# EAGLE design adaptive (EAGLE 9.6.2)

## Sheet 1 of 2
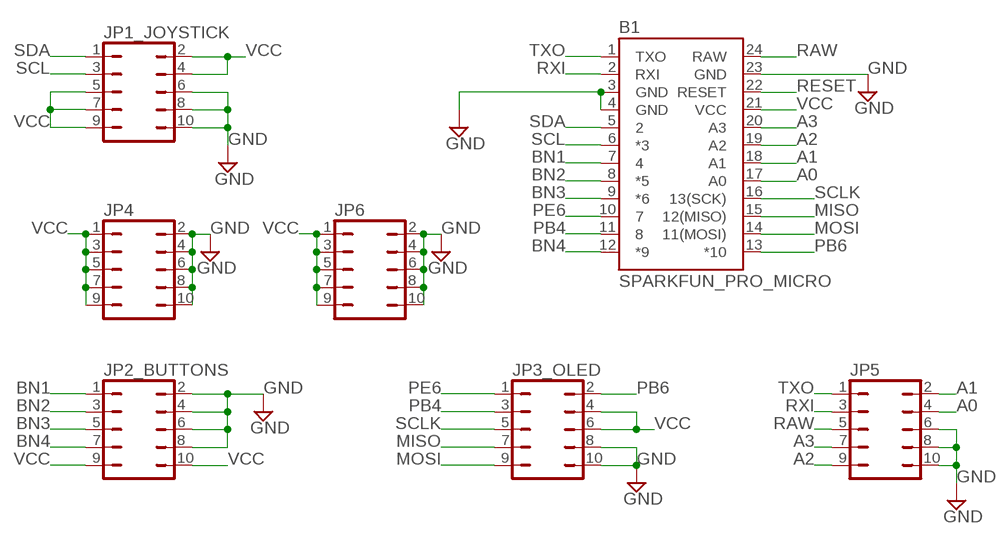
[diagram p0: schematic, sheet 1]

### Parts
B1  SPARKFUN_PRO_MICRO  [SPARKFUN_PRO_MICRO]
JP1_JOYSTICK  JP5Q  [JP5Q]
JP2_BUTTONS  JP5Q  [JP5Q]
JP3_OLED  JP5Q  [JP5Q]
JP4  JP5Q  [JP5Q]
JP5  JP5Q  [JP5Q]
JP6  JP5Q  [JP5Q]

### Nets
A0: B1.17(A0) JP5.4
A1: B1.18(A1) JP5.2
A2: B1.19(A2) JP5.9
A3: B1.20(A3) JP5.7
BN1: B1.7 JP2_BUTTONS.1
BN2: B1.8(*5) JP2_BUTTONS.3
BN3: B1.9(*6) JP2_BUTTONS.5
BN4: B1.12(*9) JP2_BUTTONS.7
GND: B1.3(GND) B1.4(GND) B1.23(GND) JP1_JOYSTICK.6 JP1_JOYSTICK.8 JP1_JOYSTICK.10 JP2_BUTTONS.2 JP2_BUTTONS.4 JP2_BUTTONS.6 JP2_BUTTONS.8 JP3_OLED.8 JP3_OLED.10 JP4.2 JP4.4 JP4.6 JP4.8 JP4.10 JP5.6 JP5.8 JP5.10 JP6.2 JP6.4 JP6.6 JP6.8 JP6.10
MISO: B1.15(12(MISO)) JP3_OLED.7
MOSI: B1.14(11(MOSI)) JP3_OLED.9
PB4: B1.11 JP3_OLED.3
PB6: B1.13(*10) JP3_OLED.2
PE6: B1.10 JP3_OLED.1
RAW: B1.24(RAW) JP5.5
RESET: B1.22(RESET)
RXI: B1.2(RXI) JP5.3
SCL: B1.6(*3) JP1_JOYSTICK.3
SCLK: B1.16(13(SCK)) JP3_OLED.5
SDA: B1.5 JP1_JOYSTICK.1
TXO: B1.1(TXO) JP5.1
VCC: B1.21(VCC) JP1_JOYSTICK.2 JP1_JOYSTICK.4 JP1_JOYSTICK.5 JP1_JOYSTICK.7 JP1_JOYSTICK.9 JP2_BUTTONS.9 JP2_BUTTONS.10 JP3_OLED.4 JP3_OLED.6 JP4.1 JP4.3 JP4.5 JP4.7 JP4.9 JP6.1 JP6.3 JP6.5 JP6.7 JP6.9

## Sheet 2 of 2

## Library data of the parts
B1 = SparkFun-Boards:SPARKFUN_PRO_MICRO: SparkFun Pro Micro Atmega32U4 compatible footprint. SparkFun Products: 3.3V/8MHz <https://www.sparkfun.com/products/12587> 5V/16MHz <https://www.sparkfun.com/products/12640>
JP1_JOYSTICK JP2_BUTTONS JP3_OLED JP4-JP6 = jumper:JP5Q: JUMPER

## Board
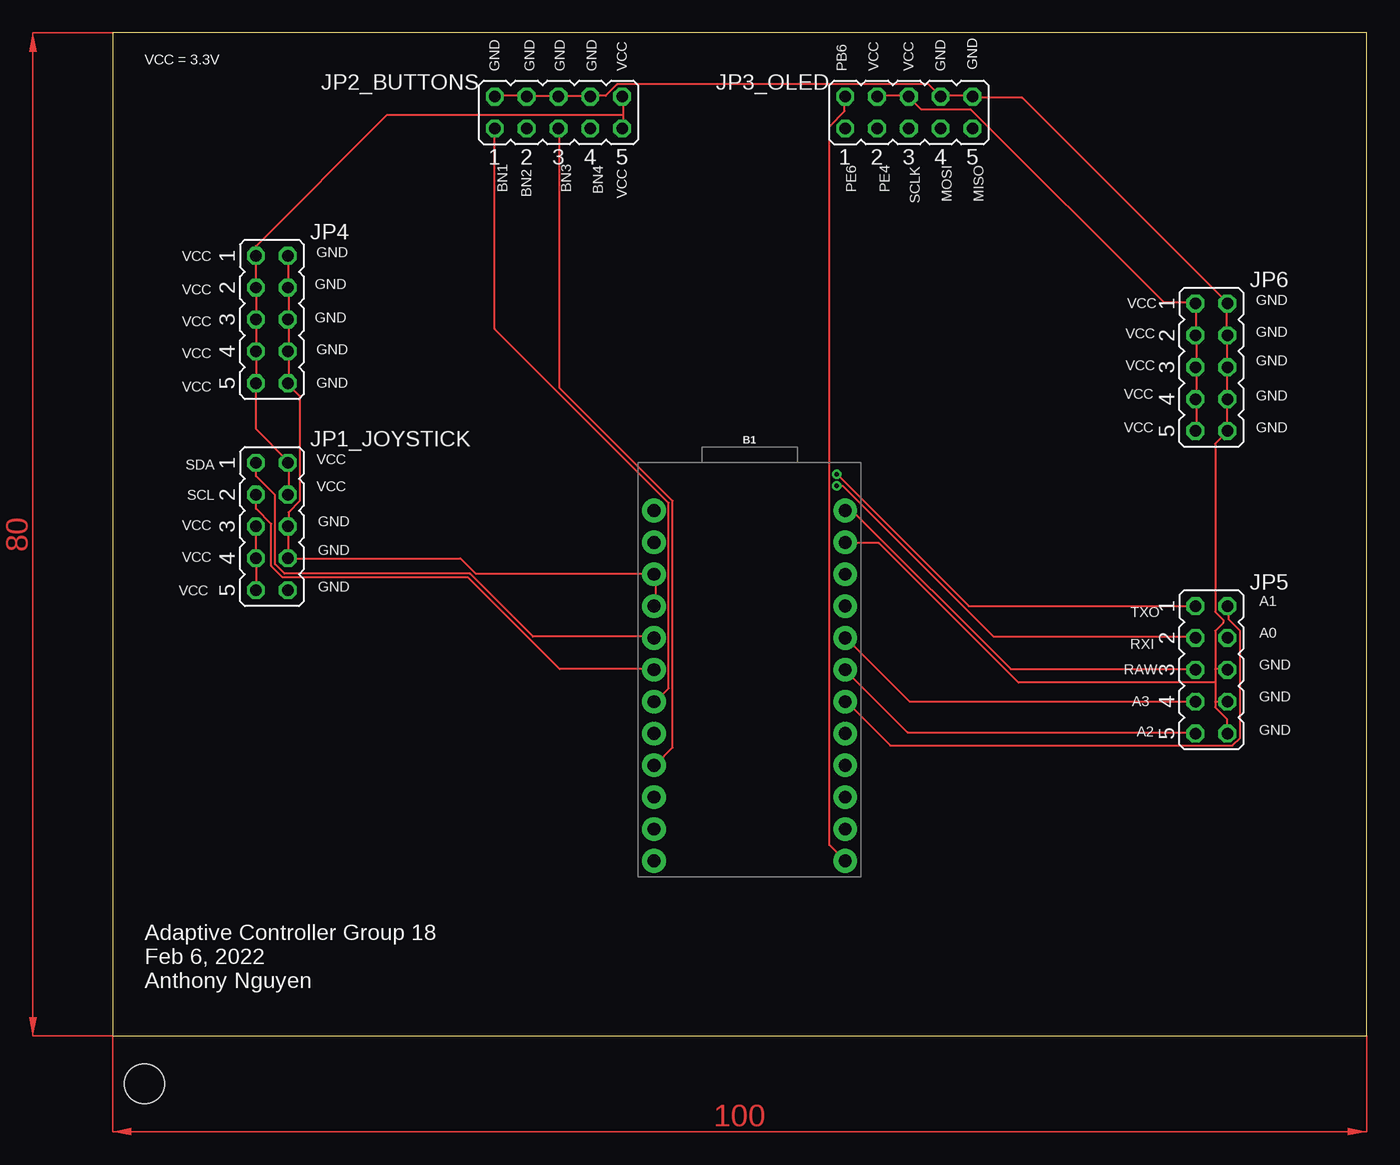
[diagram p1: board, top side]
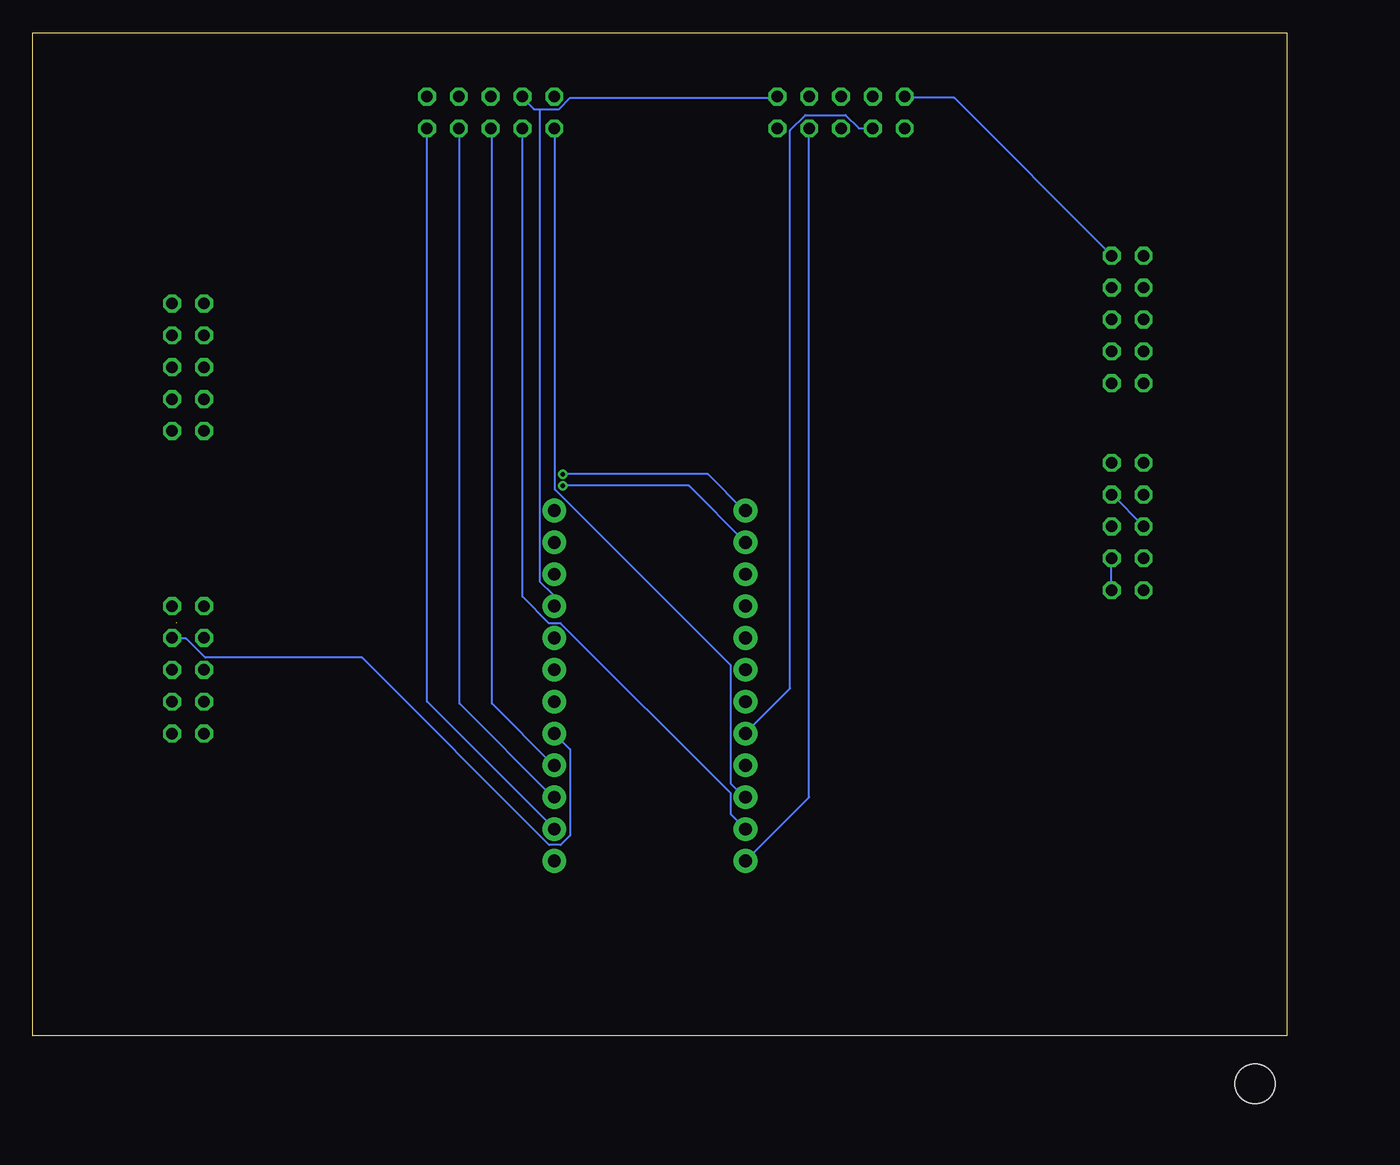
[diagram p2: board, bottom side, seen from below]

Size 100 x 80 mm. Coordinates in mm from the lower left corner, seen from the top.
Outline: 0,0 100,0 100,80 0,80 0,0
Copper layers (1*16): Top 0.035mm / dielectric 1.5mm / Bottom 0.035mm
Design rules "default": minimum track width 6mil, minimum drill 0.35mm, track to track 6mil, track to pad 6mil, pad to pad 6mil, via to via 6mil, smd to smd 6mil, copper to edge 40mil, drill to drill 6mil, minimum pad ring 10mil, minimum via ring 8mil, stop-mask expansion 4mil, vias tented up to drill 0mil, thermal gap 10mil
Holes 3.2 mm at -27.94,-34.29 -27.94,-3.81 2.54,-3.81 2.54,-34.29

### Footprints (pad centres in the part's own frame; a part is rotated, then mirrored left to right if it is on the bottom)
SPARKFUN_PRO_MICRO = drill 1.016 pad 1.88: 1 -7.62,12.7; 2 -7.62,10.16; 3 -7.62,7.62; 4 -7.62,5.08; 5 -7.62,2.54; 6 -7.62,0; 7 -7.62,-2.54; 8 -7.62,-5.08; 9 -7.62,-7.62; 10 -7.62,-10.16; 11 -7.62,-12.7; 12 -7.62,-15.24; 13 7.62,-15.24; 14 7.62,-12.7; 15 7.62,-10.16; 16 7.62,-7.62; 17 7.62,-5.08; 18 7.62,-2.54; 19 7.62,0; 20 7.62,2.54; 21 7.62,5.08; 22 7.62,7.62; 23 7.62,10.16; 24 7.62,12.7
JP5Q = drill 0.914 octagon: 1 -5.08,-1.27; 2 -5.08,1.27; 3 -2.54,-1.27; 4 -2.54,1.27; 5 0,-1.27; 6 0,1.27; 7 2.54,-1.27; 8 2.54,1.27; 9 5.08,-1.27; 10 5.08,1.27

### Placement (x,y rotation side)
B1  50.8,29.21 0 top
JP1_JOYSTICK  12.7,40.64 270 top
JP2_BUTTONS  35.56,73.66 0 top
JP3_OLED  63.5,73.66 0 top
JP4  12.7,57.15 270 top
JP5  87.63,29.21 270 top
JP6  87.63,53.34 270 top

### Tracks (layer width: path | path; a pad name or v marks a point on that pad's centre or on a via)
A0
  Bottom 0.152: B1.17 57.15,22.86 57.15,16 57.91,15.24 58.83,15.24 73.76,30.18 86.26,30.18 87.78,31.7 88.85,31.7 JP5.4
A1
  Top 0.152: JP5.2 89,34.29 89,33.22 89.92,32.31 89.92,23.77 89.31,23.16 62.03,23.16 58.52,26.67 B1.18
A2
  Top 0.152: B1.19 63.4,24.23 86.26,24.23 JP5.9
A3
  Top 0.152: JP5.7 63.55,26.67 58.52,31.7 B1.20
BN1
  Top 0.152: JP2_BUTTONS.1 30.48,56.39 44.35,42.52 44.35,27.74 43.28,26.67 B1.7
BN2
  Bottom 0.152: JP2_BUTTONS.3 34.14,72.39 35.2,73.46 38.41,73.46 39.62,72.24 39.62,27.74 43.13,24.23 B1.8
BN3
  Top 0.152: JP2_BUTTONS.5 35.66,72.39 35.66,51.66 44.65,42.67 44.65,23.01 43.28,21.64 B1.9
BN4
  Bottom 0.152: JP2_BUTTONS.7 38.1,19.05 B1.12
GND  (1 unrouted)
  Top 0.152: JP2_BUTTONS.2 30.48,74.98 32.92,74.98 JP2_BUTTONS.4 33.07,74.98 35.51,74.98 JP2_BUTTONS.6 35.66,74.98 38.1,74.98 | B1.4 43.28,34.29 43.28,36.73 B1.3 43.13,36.88 28.96,36.88 27.74,38.1 14.02,38.1 | 14.02,38.1 14.02,40.54 JP1_JOYSTICK.6 14.02,40.69 14.02,41.76 14.94,42.67 14.94,51.05 14.02,51.97 JP4.10 14.02,52.12 14.02,54.56 JP4.8 14.02,54.71 14.02,57.15 | 14.02,57.15 14.02,59.59 JP4.4 14.02,59.74 14.02,62.18 JP4.2 | 14.02,57.15 JP4.6 | 14.02,38.1 JP1_JOYSTICK.8 | 87.94,29.26 87.94,28.19 | 87.94,28.19 87.94,26.67 | 87.94,26.67 87.94,26.21 88.85,25.3 88.85,24.23 JP5.10 | 87.94,28.19 72.24,28.19 61.11,39.32 58.52,39.32 B1.23 | 88.85,53.34 88.85,55.78 JP6.4 88.85,55.93 88.85,58.37 JP6.2 88.85,58.52 72.54,74.83 68.58,74.83 JP3_OLED.10 68.58,74.98 66.14,74.98 JP3_OLED.8 65.08,75.89 40.23,75.89 39.32,74.98 38.1,74.98 | 88.85,53.34 88.85,50.9 JP6.8 88.85,50.75 88.85,48.31 JP6.10 88.85,48.16 87.94,47.24 87.94,33.83 88.59,33.17 88.59,32.99 | 88.85,53.34 JP6.6 | 38.1,74.98 JP2_BUTTONS.8 | 87.94,26.67 JP5.8 | 87.94,29.26 88.85,29.26 JP5.6 | 87.94,29.26 87.94,32.31 88.57,32.94
  Bottom 0.152: JP1_JOYSTICK.10 14.02,35.66 14.02,38.1 JP1_JOYSTICK.8 | JP2_BUTTONS.2 30.48,74.83 26.52,74.83 14.02,62.33 JP4.2
MISO
  Bottom 0.152: JP3_OLED.7 65.99,72.39 65.99,26.52 58.52,19.05 B1.15
MOSI
  Bottom 0.152: JP3_OLED.9 68.58,26.67 B1.14
PB4
  Bottom 0.152: JP3_OLED.3 60.96,35.05 58.83,32.92 57.91,32.92 44.35,19.36 44.35,17.68 B1.11
PB6
  Top 0.152: B1.13 57.15,15.24 57.15,72.54 58.37,73.76 58.37,74.83 JP3_OLED.2
PE6
  Bottom 0.152: JP3_OLED.1 58.37,72.39 58.37,43.59 44.35,29.57 44.35,20.12 43.28,19.05 B1.10
RAW
  Top 0.152: JP5.5 86.26,29.26 71.63,29.26 58.98,41.91 B1.24
RXI  (via drill 0.35)
  Top 0.152: v57.76,43.89 58.22,43.89 70.26,31.85 86.26,31.85 JP5.3
  Bottom 0.152: v57.76,43.89 47.7,43.89 B1.2
SCL
  Top 0.152: JP1_JOYSTICK.3 11.43,42.06 12.65,40.84 12.65,37.49 13.56,36.58 28.35,36.58 35.66,29.26 43.13,29.26 B1.6
SCLK
  Bottom 0.152: JP3_OLED.5 63.4,72.39 63.4,26.52 58.52,21.64 B1.16
SDA
  Top 0.152: JP1_JOYSTICK.1 11.43,44.65 12.95,43.13 12.95,37.64 13.72,36.88 28.5,36.88 33.53,31.85 43.13,31.85 B1.5
TXO  (via drill 0.35)
  Top 0.152: JP5.1 68.28,34.29 v57.76,44.81
  Bottom 0.152: v57.76,44.81 46.18,44.81 43.28,41.91 B1.1
VCC
  Top 0.152: JP1_JOYSTICK.4 14.02,43.28 14.02,45.72 JP1_JOYSTICK.2 13.97,45.87 11.43,48.41 JP4.9 JP4.7 JP4.5 JP4.3 JP4.1 11.43,63.02 21.87,73.46 40.69,73.46 | JP1_JOYSTICK.9 JP1_JOYSTICK.7 JP1_JOYSTICK.5 | JP6.9 86.41,48.31 86.41,50.75 JP6.7 86.41,50.9 86.41,53.34 | 86.41,53.34 86.41,55.78 JP6.3 86.41,55.93 86.41,58.37 JP6.1 86.26,58.52 83.82,58.52 68.43,73.91 64.47,73.91 63.55,74.83 JP3_OLED.6 63.4,74.98 60.96,74.98 JP3_OLED.4 | 86.41,53.34 JP6.5 | 40.69,73.46 40.69,74.83 JP2_BUTTONS.10 | 40.69,73.46 40.69,72.39 JP2_BUTTONS.9
  Bottom 0.152: JP1_JOYSTICK.4 13.87,43.13 11.43,40.69 JP1_JOYSTICK.5 | 59.59,73.91 60.05,73.91 60.96,74.83 JP3_OLED.4 | 59.59,73.91 58.06,73.91 57.15,74.83 40.69,74.83 JP2_BUTTONS.10 | 59.59,73.91 59.59,36.27 58.52,35.2 58.52,34.29 B1.21
(copper drawn outside any net)
  shapes: Top area x2

### Text on the board
tPlace: VCC = 3.3V | GND | GND | GND | GND | VCC | PB6 | VCC | VCC | GND | GND | BN1 | BN2 | BN3 | BN4 | VCC | PE6 | PE4 | MOSI | MISO | SCLK | VCC | GND | VCC | GND | VCC | GND | VCC | GND | VCC | GND | VCC | GND | VCC | GND | VCC | GND | VCC | GND | VCC | GND | SDA | VCC | SCL | VCC | VCC | GND | VCC | GND | VCC | GND | A1 | TXO | A0 | RXI | RAW | GND | GND | A3 | A2 | GND | Adaptive Controller Group 18 / Feb 6, 2022 / Anthony Nguyen